# Altium schematic sheet Преобразователь.SchDoc
size 209 x 297 mm; Author: Скляр Р.С.; Organization: S-LAB; Address1: 2436.181092.5167; DocumentNumber: 2; SheetNumber: 2; SheetTotal: 3; PageSetup: Record=PageOptions|CenterHorizontal=True|CenterVertical=True|PrintScale=0.94|XCorrection=1.00|YCorrection=1.00|PrintKind=1|BorderSize=5000000|LeftOffset=0|BottomOffset=0|Orientation=1|PaperLength=1000|PaperWidth=1000|Scale=100|PaperSource=7|PrintQuality=-4|MediaType=1|DitherType=10|PaperKind=A4|PrintScaleMode=1; Name: Контроллер управления; Name1: USB-DMX512; Scale: 1:1; DocumentName: Sheet1.SCHDOC
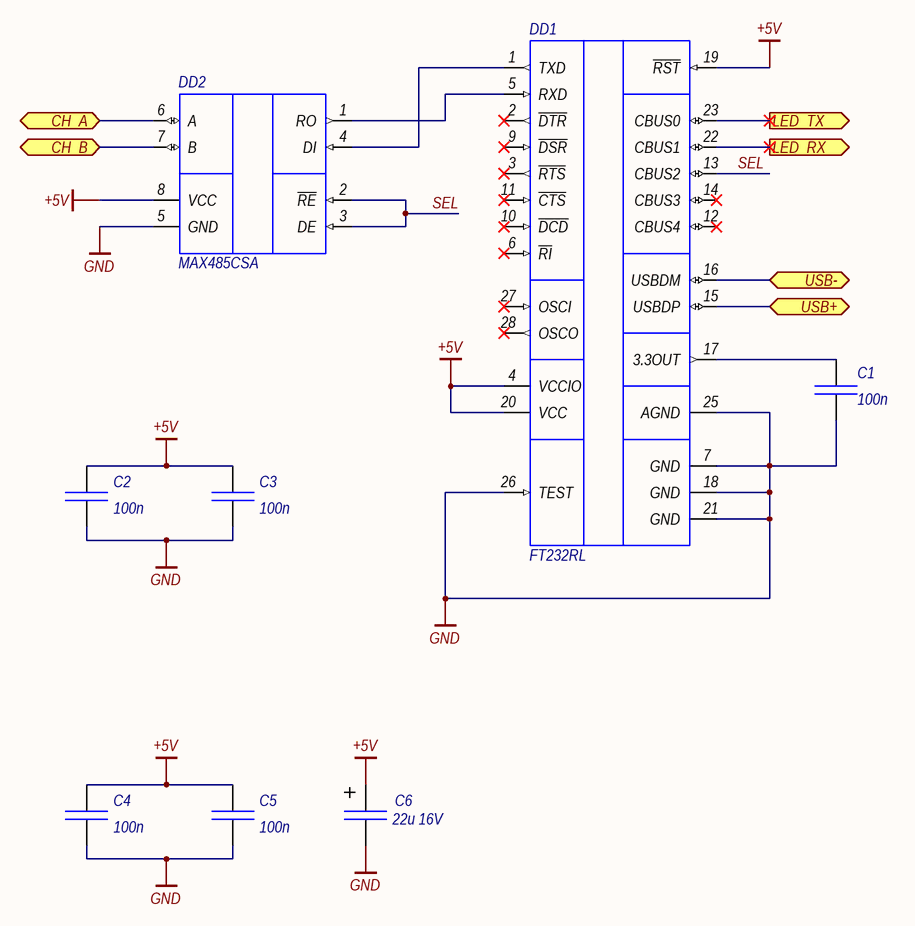
[diagram p0: Преобразователь.SchDoc]

## Parts
C1  value 100n  [C0603]  (hidden comment: Cap 100n)
C2  value 100n  [C0603]  (hidden comment: Cap 100n)
C3  value 100n  [C0603]  (hidden comment: Cap 100n)
C4  value 100n  [C0603]  (hidden comment: Cap 100n)
C5  value 100n  [C0603]  (hidden comment: Cap 100n)
C6  22u 16V  [Cap EL B]
DD1  FT232RL  [SSOP28]
DD2  MAX485CSA  [SOIC8]

## Ports
CH_A (bidir), CH_B (bidir), LED_RX (out), LED_TX (out), USB+ (bidir), USB- (bidir)

## Nets
+5V: C2.2 C3.2 C4.2 C5.2 C6.2 DD1.4(VCCIO) DD1.19(~{RST}) DD1.20(VCC) DD2.8(VCC)
GND: C1.1 C2.1 C3.1 C4.1 C5.1 C6.1 DD1.7(GND) DD1.18(GND) DD1.21(GND) DD1.25(AGND) DD1.26(TEST) DD2.5(GND)
CH_A: DD2.6(A) ; port CH_A
CH_B: DD2.7(B) ; port CH_B
LED_RX: DD1.22(CBUS1) ; port LED_RX
LED_TX: DD1.23(CBUS0) ; port LED_TX
SEL: DD1.13(CBUS2) DD2.2(~{RE}) DD2.3(DE)
USB+: DD1.15(USBDP) ; port USB+
USB-: DD1.16(USBDM) ; port USB-
NetC1_2: C1.2 DD1.17(3.3OUT)
NetDD1_1: DD1.1(TXD) DD2.4(DI)
NetDD1_5: DD1.5(RXD) DD2.1(RO)

Not connected (* = marked no-connect by the designer): DD1 2(~{DTR})* 3(~{RTS})* 6(~{RI})* 9(~{DSR})* 10(~{DCD})* 11(~{CTS})* 12(CBUS4)* 14(CBUS3)* 27(OSCI)* 28(OSCO)*

## Notes on the sheet
- Перв.примен.
- Справ.№
- Подп. и дата
- Инв.№ дубл.
- Взам.инв.№
- Подп.и дата
- Разраб.
- Изм.
- Лист
- № докум.
- Подп.
- Дата
- Лит.
- Масса
- Масштаб
- Т.контр.
- Пров.
- Схема электрическая
- принципиальная
- Листов
- Инв.№ подл.
- Утв.
- Н.контр.
- Нач.сект.
- Копировал
- Формат  A4

## Library data of the parts
C1-C5 = Cap 100n: Type: Конденсатор
C6 = 22u 16V: Type: Конденсатор; Value: 22u 16V
DD1 = FT232RL: USB to UART Converter; Type: Микросхема; Value: FT232RL
DD2 = MAX485CSA: HALF DUPLEX; Type: Микросхема; Value: MAX485CSA